# EAGLE schematic sketch_v1.01 (EAGLE 7.6.0)
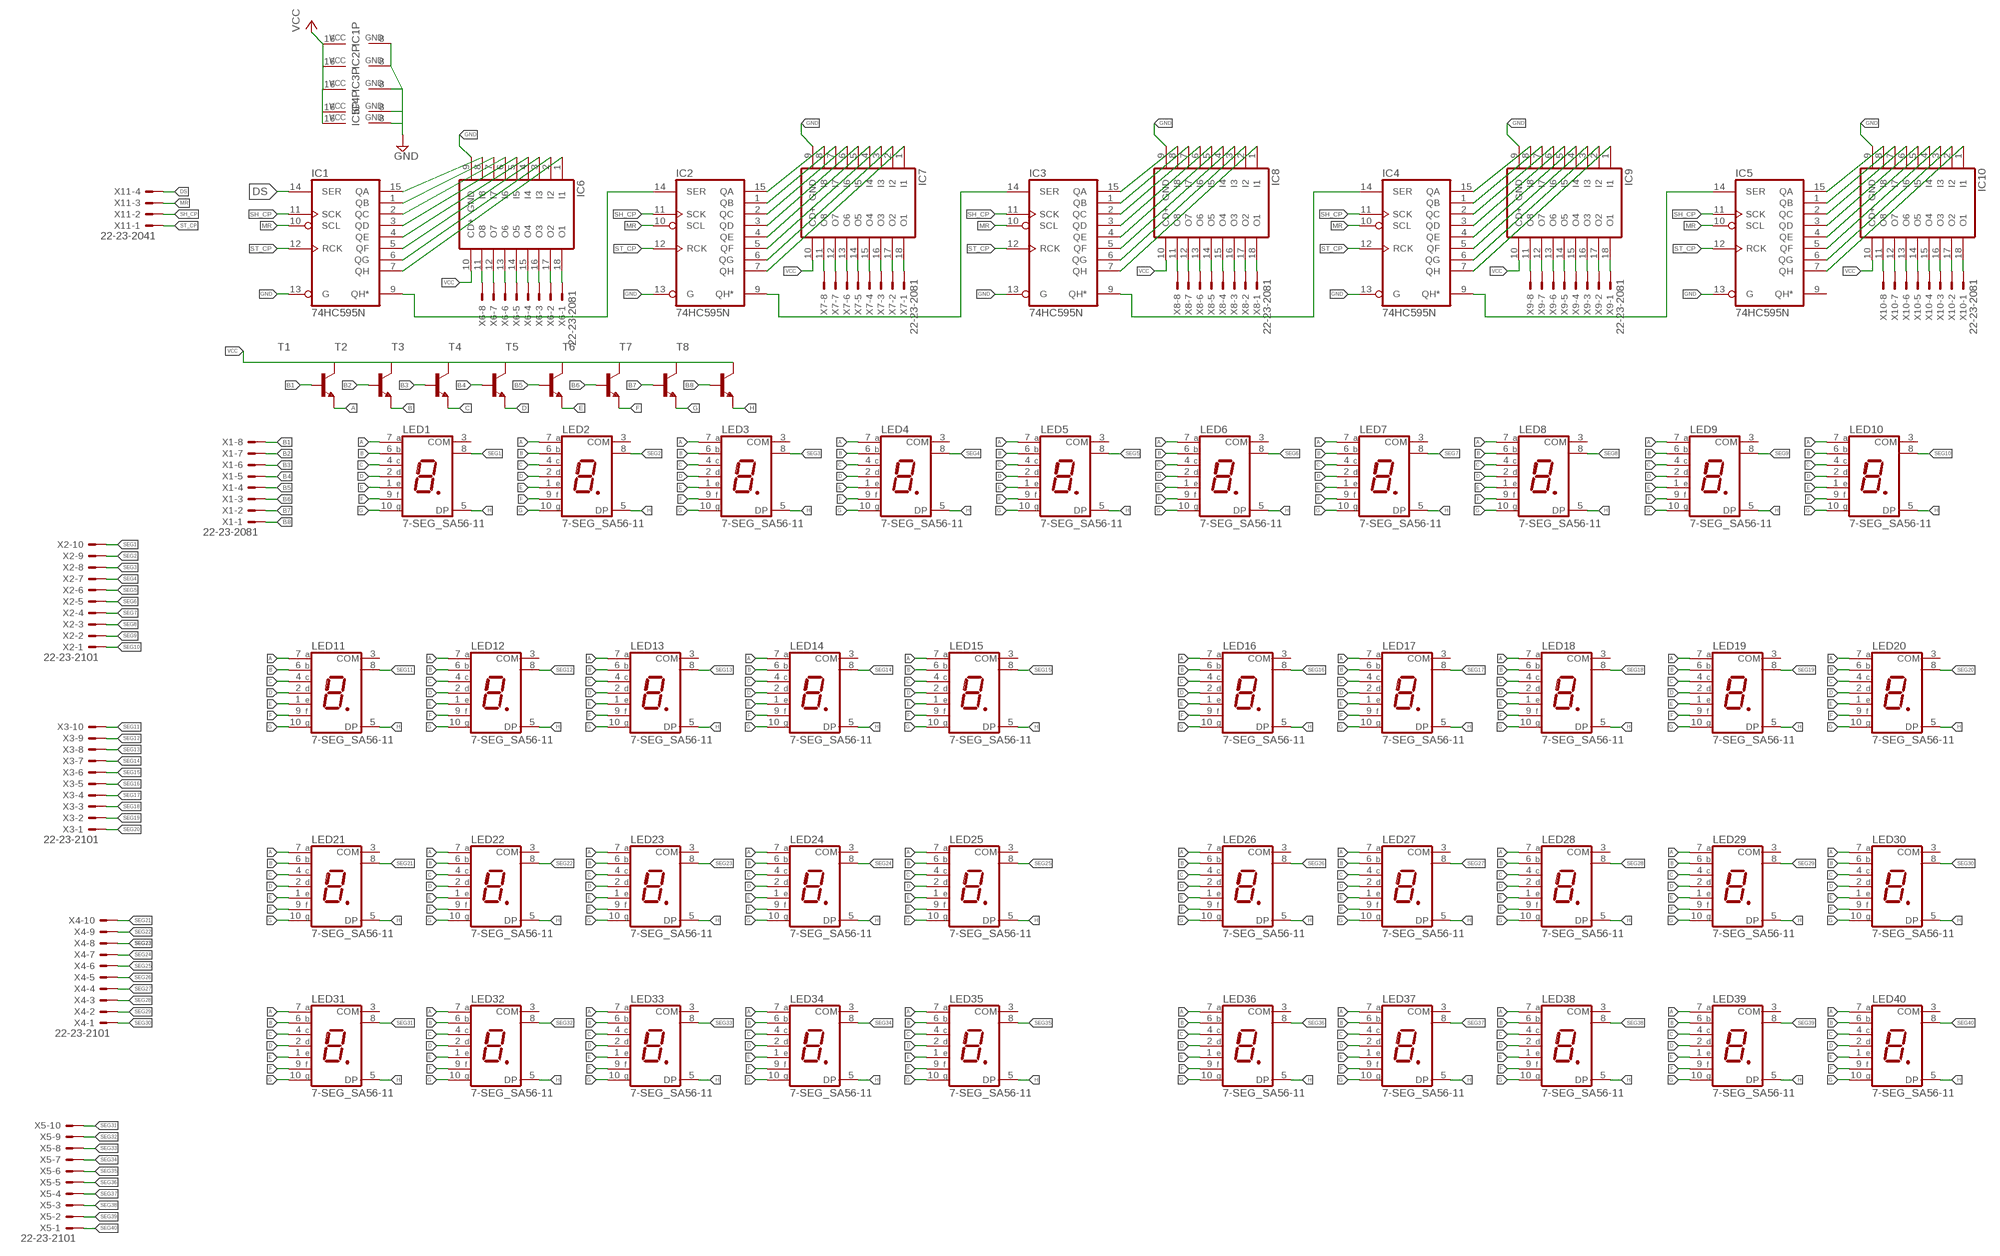
[diagram p0: schematic, sheet 1]

## Parts
IC1  74HC595N  [DIL16]
IC2  74HC595N  [DIL16]
IC3  74HC595N  [DIL16]
IC4  74HC595N  [DIL16]
IC5  74HC595N  [DIL16]
IC6  ULN2803A  [DIL18]
IC7  ULN2803A  [DIL18]
IC8  ULN2803A  [DIL18]
IC9  ULN2803A  [DIL18]
IC10  ULN2803A  [DIL18]
LED1  7-SEG_SA56-11  [SA56-11]
LED2  7-SEG_SA56-11  [SA56-11]
LED3  7-SEG_SA56-11  [SA56-11]
LED4  7-SEG_SA56-11  [SA56-11]
LED5  7-SEG_SA56-11  [SA56-11]
LED6  7-SEG_SA56-11  [SA56-11]
LED7  7-SEG_SA56-11  [SA56-11]
LED8  7-SEG_SA56-11  [SA56-11]
LED9  7-SEG_SA56-11  [SA56-11]
LED10  7-SEG_SA56-11  [SA56-11]
LED11  7-SEG_SA56-11  [SA56-11]
LED12  7-SEG_SA56-11  [SA56-11]
LED13  7-SEG_SA56-11  [SA56-11]
LED14  7-SEG_SA56-11  [SA56-11]
LED15  7-SEG_SA56-11  [SA56-11]
LED16  7-SEG_SA56-11  [SA56-11]
LED17  7-SEG_SA56-11  [SA56-11]
LED18  7-SEG_SA56-11  [SA56-11]
LED19  7-SEG_SA56-11  [SA56-11]
LED20  7-SEG_SA56-11  [SA56-11]
LED21  7-SEG_SA56-11  [SA56-11]
LED22  7-SEG_SA56-11  [SA56-11]
LED23  7-SEG_SA56-11  [SA56-11]
LED24  7-SEG_SA56-11  [SA56-11]
LED25  7-SEG_SA56-11  [SA56-11]
LED26  7-SEG_SA56-11  [SA56-11]
LED27  7-SEG_SA56-11  [SA56-11]
LED28  7-SEG_SA56-11  [SA56-11]
LED29  7-SEG_SA56-11  [SA56-11]
LED30  7-SEG_SA56-11  [SA56-11]
LED31  7-SEG_SA56-11  [SA56-11]
LED32  7-SEG_SA56-11  [SA56-11]
LED33  7-SEG_SA56-11  [SA56-11]
LED34  7-SEG_SA56-11  [SA56-11]
LED35  7-SEG_SA56-11  [SA56-11]
LED36  7-SEG_SA56-11  [SA56-11]
LED37  7-SEG_SA56-11  [SA56-11]
LED38  7-SEG_SA56-11  [SA56-11]
LED39  7-SEG_SA56-11  [SA56-11]
LED40  7-SEG_SA56-11  [SA56-11]
T1  -NPN-TO92  [TO92]
T2  -NPN-TO92  [TO92]
T3  -NPN-TO92  [TO92]
T4  -NPN-TO92  [TO92]
T5  -NPN-TO92  [TO92]
T6  -NPN-TO92  [TO92]
T7  -NPN-TO92  [TO92]
T8  -NPN-TO92  [TO92]
X1  22-23-2081  [22-23-2081]
X2  22-23-2101  [22-23-2101]
X3  22-23-2101  [22-23-2101]
X4  22-23-2101  [22-23-2101]
X5  22-23-2101  [22-23-2101]
X6  22-23-2081  [22-23-2081]
X7  22-23-2081  [22-23-2081]
X8  22-23-2081  [22-23-2081]
X9  22-23-2081  [22-23-2081]
X10  22-23-2081  [22-23-2081]
X11  22-23-2041  [22-23-2041]

## Nets
A: LED1.7(A) LED2.7(A) LED3.7(A) LED4.7(A) LED5.7(A) LED6.7(A) LED7.7(A) LED8.7(A) LED9.7(A) LED10.7(A) LED11.7(A) LED12.7(A) LED13.7(A) LED14.7(A) LED15.7(A) LED16.7(A) LED17.7(A) LED18.7(A) LED19.7(A) LED20.7(A) LED21.7(A) LED22.7(A) LED23.7(A) LED24.7(A) LED25.7(A) LED26.7(A) LED27.7(A) LED28.7(A) LED29.7(A) LED30.7(A) LED31.7(A) LED32.7(A) LED33.7(A) LED34.7(A) LED35.7(A) LED36.7(A) LED37.7(A) LED38.7(A) LED39.7(A) LED40.7(A) T1.1(E)
B: LED1.6(B) LED2.6(B) LED3.6(B) LED4.6(B) LED5.6(B) LED6.6(B) LED7.6(B) LED8.6(B) LED9.6(B) LED10.6(B) LED11.6(B) LED12.6(B) LED13.6(B) LED14.6(B) LED15.6(B) LED16.6(B) LED17.6(B) LED18.6(B) LED19.6(B) LED20.6(B) LED21.6(B) LED22.6(B) LED23.6(B) LED24.6(B) LED25.6(B) LED26.6(B) LED27.6(B) LED28.6(B) LED29.6(B) LED30.6(B) LED31.6(B) LED32.6(B) LED33.6(B) LED34.6(B) LED35.6(B) LED36.6(B) LED37.6(B) LED38.6(B) LED39.6(B) LED40.6(B) T2.1(E)
B1: T1.2(B) X1.8
B2: T2.2(B) X1.7
B3: T3.2(B) X1.6
B4: T4.2(B) X1.5
B5: T5.2(B) X1.4
B6: T6.2(B) X1.3
B7: T7.2(B) X1.2
B8: T8.2(B) X1.1
C: LED1.4(C) LED2.4(C) LED3.4(C) LED4.4(C) LED5.4(C) LED6.4(C) LED7.4(C) LED8.4(C) LED9.4(C) LED10.4(C) LED11.4(C) LED12.4(C) LED13.4(C) LED14.4(C) LED15.4(C) LED16.4(C) LED17.4(C) LED18.4(C) LED19.4(C) LED20.4(C) LED21.4(C) LED22.4(C) LED23.4(C) LED24.4(C) LED25.4(C) LED26.4(C) LED27.4(C) LED28.4(C) LED29.4(C) LED30.4(C) LED31.4(C) LED32.4(C) LED33.4(C) LED34.4(C) LED35.4(C) LED36.4(C) LED37.4(C) LED38.4(C) LED39.4(C) LED40.4(C) T3.1(E)
D: LED1.2(D) LED2.2(D) LED3.2(D) LED4.2(D) LED5.2(D) LED6.2(D) LED7.2(D) LED8.2(D) LED9.2(D) LED10.2(D) LED11.2(D) LED12.2(D) LED13.2(D) LED14.2(D) LED15.2(D) LED16.2(D) LED17.2(D) LED18.2(D) LED19.2(D) LED20.2(D) LED21.2(D) LED22.2(D) LED23.2(D) LED24.2(D) LED25.2(D) LED26.2(D) LED27.2(D) LED28.2(D) LED29.2(D) LED30.2(D) LED31.2(D) LED32.2(D) LED33.2(D) LED34.2(D) LED35.2(D) LED36.2(D) LED37.2(D) LED38.2(D) LED39.2(D) LED40.2(D) T4.1(E)
DS: IC1.14(SER) X11.4
E: LED1.1(E) LED2.1(E) LED3.1(E) LED4.1(E) LED5.1(E) LED6.1(E) LED7.1(E) LED8.1(E) LED9.1(E) LED10.1(E) LED11.1(E) LED12.1(E) LED13.1(E) LED14.1(E) LED15.1(E) LED16.1(E) LED17.1(E) LED18.1(E) LED19.1(E) LED20.1(E) LED21.1(E) LED22.1(E) LED23.1(E) LED24.1(E) LED25.1(E) LED26.1(E) LED27.1(E) LED28.1(E) LED29.1(E) LED30.1(E) LED31.1(E) LED32.1(E) LED33.1(E) LED34.1(E) LED35.1(E) LED36.1(E) LED37.1(E) LED38.1(E) LED39.1(E) LED40.1(E) T5.1(E)
F: LED1.9(F) LED2.9(F) LED3.9(F) LED4.9(F) LED5.9(F) LED6.9(F) LED7.9(F) LED8.9(F) LED9.9(F) LED10.9(F) LED11.9(F) LED12.9(F) LED13.9(F) LED14.9(F) LED15.9(F) LED16.9(F) LED17.9(F) LED18.9(F) LED19.9(F) LED20.9(F) LED21.9(F) LED22.9(F) LED23.9(F) LED24.9(F) LED25.9(F) LED26.9(F) LED27.9(F) LED28.9(F) LED29.9(F) LED30.9(F) LED31.9(F) LED32.9(F) LED33.9(F) LED34.9(F) LED35.9(F) LED36.9(F) LED37.9(F) LED38.9(F) LED39.9(F) LED40.9(F) T6.1(E)
G: LED1.10(G) LED2.10(G) LED3.10(G) LED4.10(G) LED5.10(G) LED6.10(G) LED7.10(G) LED8.10(G) LED9.10(G) LED10.10(G) LED11.10(G) LED12.10(G) LED13.10(G) LED14.10(G) LED15.10(G) LED16.10(G) LED17.10(G) LED18.10(G) LED19.10(G) LED20.10(G) LED21.10(G) LED22.10(G) LED23.10(G) LED24.10(G) LED25.10(G) LED26.10(G) LED27.10(G) LED28.10(G) LED29.10(G) LED30.10(G) LED31.10(G) LED32.10(G) LED33.10(G) LED34.10(G) LED35.10(G) LED36.10(G) LED37.10(G) LED38.10(G) LED39.10(G) LED40.10(G) T7.1(E)
GND: IC1.8(GND) IC1.13(G) IC2.8(GND) IC2.13(G) IC3.8(GND) IC3.13(G) IC4.8(GND) IC4.13(G) IC5.8(GND) IC5.13(G) IC6.9(GND) IC7.9(GND) IC8.9(GND) IC9.9(GND) IC10.9(GND)
H: LED1.5(DP) LED2.5(DP) LED3.5(DP) LED4.5(DP) LED5.5(DP) LED6.5(DP) LED7.5(DP) LED8.5(DP) LED9.5(DP) LED10.5(DP) LED11.5(DP) LED12.5(DP) LED13.5(DP) LED14.5(DP) LED15.5(DP) LED16.5(DP) LED17.5(DP) LED18.5(DP) LED19.5(DP) LED20.5(DP) LED21.5(DP) LED22.5(DP) LED23.5(DP) LED24.5(DP) LED25.5(DP) LED26.5(DP) LED27.5(DP) LED28.5(DP) LED29.5(DP) LED30.5(DP) LED31.5(DP) LED32.5(DP) LED33.5(DP) LED34.5(DP) LED35.5(DP) LED36.5(DP) LED37.5(DP) LED38.5(DP) LED39.5(DP) LED40.5(DP) T8.1(E)
MR: IC1.10(SCL) IC2.10(SCL) IC3.10(SCL) IC4.10(SCL) IC5.10(SCL) X11.3
N$1: IC1.15(QA) IC6.8(I8)
N$2: IC1.1(QB) IC6.7(I7)
N$3: IC1.2(QC) IC6.6(I6)
N$4: IC1.3(QD) IC6.5(I5)
N$5: IC1.4(QE) IC6.4(I4)
N$6: IC1.5(QF) IC6.3(I3)
N$7: IC1.6(QG) IC6.2(I2)
N$8: IC1.7(QH) IC6.1(I1)
N$9: IC2.15(QA) IC7.8(I8)
N$10: IC2.1(QB) IC7.7(I7)
N$11: IC2.2(QC) IC7.6(I6)
N$12: IC2.3(QD) IC7.5(I5)
N$13: IC2.4(QE) IC7.4(I4)
N$14: IC2.5(QF) IC7.3(I3)
N$15: IC2.6(QG) IC7.2(I2)
N$16: IC2.7(QH) IC7.1(I1)
N$17: IC3.15(QA) IC8.8(I8)
N$18: IC3.1(QB) IC8.7(I7)
N$19: IC3.2(QC) IC8.6(I6)
N$20: IC3.3(QD) IC8.5(I5)
N$21: IC3.4(QE) IC8.4(I4)
N$22: IC3.5(QF) IC8.3(I3)
N$23: IC3.6(QG) IC8.2(I2)
N$24: IC3.7(QH) IC8.1(I1)
N$25: IC4.15(QA) IC9.8(I8)
N$26: IC4.1(QB) IC9.7(I7)
N$27: IC4.2(QC) IC9.6(I6)
N$28: IC4.3(QD) IC9.5(I5)
N$29: IC4.4(QE) IC9.4(I4)
N$30: IC4.5(QF) IC9.3(I3)
N$31: IC4.6(QG) IC9.2(I2)
N$32: IC4.7(QH) IC9.1(I1)
N$33: IC5.15(QA) IC10.8(I8)
N$34: IC5.1(QB) IC10.7(I7)
N$35: IC5.2(QC) IC10.6(I6)
N$36: IC5.3(QD) IC10.5(I5)
N$37: IC5.4(QE) IC10.4(I4)
N$38: IC5.5(QF) IC10.3(I3)
N$39: IC5.6(QG) IC10.2(I2)
N$40: IC5.7(QH) IC10.1(I1)
N$41: IC1.9(QH*) IC2.14(SER)
N$42: IC6.11(O8) X6.8
N$43: IC6.12(O7) X6.7
N$44: IC6.13(O6) X6.6
N$45: IC6.14(O5) X6.5
N$46: IC6.15(O4) X6.4
N$47: IC6.16(O3) X6.3
N$48: IC6.17(O2) X6.2
N$49: IC6.18(O1) X6.1
N$50: IC7.11(O8) X7.8
N$51: IC7.12(O7) X7.7
N$52: IC7.13(O6) X7.6
N$53: IC7.14(O5) X7.5
N$54: IC7.15(O4) X7.4
N$55: IC7.16(O3) X7.3
N$56: IC7.17(O2) X7.2
N$57: IC7.18(O1) X7.1
N$58: IC8.11(O8) X8.8
N$59: IC8.12(O7) X8.7
N$60: IC8.13(O6) X8.6
N$61: IC8.14(O5) X8.5
N$62: IC8.15(O4) X8.4
N$63: IC8.16(O3) X8.3
N$64: IC8.17(O2) X8.2
N$65: IC8.18(O1) X8.1
N$66: IC9.11(O8) X9.8
N$67: IC9.12(O7) X9.7
N$68: IC9.13(O6) X9.6
N$69: IC9.14(O5) X9.5
N$70: IC9.15(O4) X9.4
N$71: IC9.16(O3) X9.3
N$72: IC9.17(O2) X9.2
N$73: IC9.18(O1) X9.1
N$74: IC10.11(O8) X10.8
N$75: IC10.12(O7) X10.7
N$76: IC10.13(O6) X10.6
N$77: IC10.14(O5) X10.5
N$78: IC10.15(O4) X10.4
N$79: IC10.16(O3) X10.3
N$80: IC10.17(O2) X10.2
N$81: IC10.18(O1) X10.1
N$103: IC2.9(QH*) IC3.14(SER)
N$112: IC3.9(QH*) IC4.14(SER)
N$121: IC4.9(QH*) IC5.14(SER)
SEG1: LED1.8(COM) X2.10
SEG2: LED2.8(COM) X2.9
SEG3: LED3.8(COM) X2.8
SEG4: LED4.8(COM) X2.7
SEG5: LED5.8(COM) X2.6
SEG6: LED6.8(COM) X2.5
SEG7: LED7.8(COM) X2.4
SEG8: LED8.8(COM) X2.3
SEG9: LED9.8(COM) X2.2
SEG10: LED10.8(COM) X2.1
SEG11: LED11.8(COM) X3.10
SEG12: LED12.8(COM) X3.9
SEG13: LED13.8(COM) X3.8
SEG14: LED14.8(COM) X3.7
SEG15: LED15.8(COM) X3.6
SEG16: LED16.8(COM) X3.5
SEG17: LED17.8(COM) X3.4
SEG18: LED18.8(COM) X3.3
SEG19: LED19.8(COM) X3.2
SEG20: LED20.8(COM) X3.1
SEG21: LED21.8(COM) X4.10
SEG22: LED22.8(COM) X4.9
SEG23: LED23.8(COM) X4.8
SEG24: LED24.8(COM) X4.7
SEG25: LED25.8(COM) X4.6
SEG26: LED26.8(COM) X4.5
SEG27: LED27.8(COM) X4.4
SEG28: LED28.8(COM) X4.3
SEG29: LED29.8(COM) X4.2
SEG30: LED30.8(COM) X4.1
SEG31: LED31.8(COM) X5.10
SEG32: LED32.8(COM) X5.9
SEG33: LED33.8(COM) X5.8
SEG34: LED34.8(COM) X5.7
SEG35: LED35.8(COM) X5.6
SEG36: LED36.8(COM) X5.5
SEG37: LED37.8(COM) X5.4
SEG38: LED38.8(COM) X5.3
SEG39: LED39.8(COM) X5.2
SEG40: LED40.8(COM) X5.1
SH_CP: IC1.11(SCK) IC2.11(SCK) IC3.11(SCK) IC4.11(SCK) IC5.11(SCK) X11.2
ST_CP: IC1.12(RCK) IC2.12(RCK) IC3.12(RCK) IC4.12(RCK) IC5.12(RCK) X11.1
VCC: IC1.16(VCC) IC2.16(VCC) IC3.16(VCC) IC4.16(VCC) IC5.16(VCC) IC6.10(CD+) IC7.10(CD+) IC8.10(CD+) IC9.10(CD+) IC10.10(CD+) T1.3(C) T2.3(C) T3.3(C) T4.3(C) T5.3(C) T6.3(C) T7.3(C) T8.3(C)
Unconnected: IC5.9(QH*) LED1.3(COM) LED2.3(COM) LED3.3(COM) LED4.3(COM) LED5.3(COM) LED6.3(COM) LED7.3(COM) LED8.3(COM) LED9.3(COM) LED10.3(COM) LED11.3(COM) LED12.3(COM) LED13.3(COM) LED14.3(COM) LED15.3(COM) LED16.3(COM) LED17.3(COM) LED18.3(COM) LED19.3(COM) LED20.3(COM) LED21.3(COM) LED22.3(COM) LED23.3(COM) LED24.3(COM) LED25.3(COM) LED26.3(COM) LED27.3(COM) LED28.3(COM) LED29.3(COM) LED30.3(COM) LED31.3(COM) LED32.3(COM) LED33.3(COM) LED34.3(COM) LED35.3(COM) LED36.3(COM) LED37.3(COM) LED38.3(COM) LED39.3(COM) LED40.3(COM)

## Library data of the parts
IC1-IC5 = 74xx-eu:74*595: 8-bit SHIFT REGISTER, output latch
IC6-IC10 = uln-udn:ULN2803A: DRIVER ARRAY
LED1-LED40 = display-kingbright-2:7-SEG_: Kingbright 14.2mm (0.56 INCH) SINGLE DIGIT NUMERIC DUISPLAY Source: SA56-11EWA(Ver1189471036.pdf
T1-T8 = transistor:*-NPN-: NPN Transistror BF959 corrected 2008.03.06
X1 X6-X10 = con-molex:22-23-2081: .100" (2.54mm) Center Header - 8 Pin; MF: MOLEX; MPN: 22-23-2081; OC_FARNELL: 1756826; OC_NEWARK: 01C7592
X2-X5 = con-molex:22-23-2101: .100" (2.54mm) Center Header - 10 Pin; MF: MOLEX; MPN: 22-23-2101; OC_FARNELL: 1756828; OC_NEWARK: 94C0765
X11 = con-molex:22-23-2041: .100" (2.54mm) Center Header - 4 Pin; MF: MOLEX; MPN: 22-23-2041; OC_FARNELL: 1462920; OC_NEWARK: 38C0355

## Net classes
0 default: width 0.914 mm, clearance 0.457 mm